# Altium schematic sheet PIC32MK_ACB.SchDoc: PIC32MK
size A4; Author: Milomir Spajić; Organization: Memristor-Robotics; Address1: Vladimira Perića Valtera; Address2: Novi Sad, 21000; Address3: Serbia; SheetNumber: 8; SheetTotal: 13
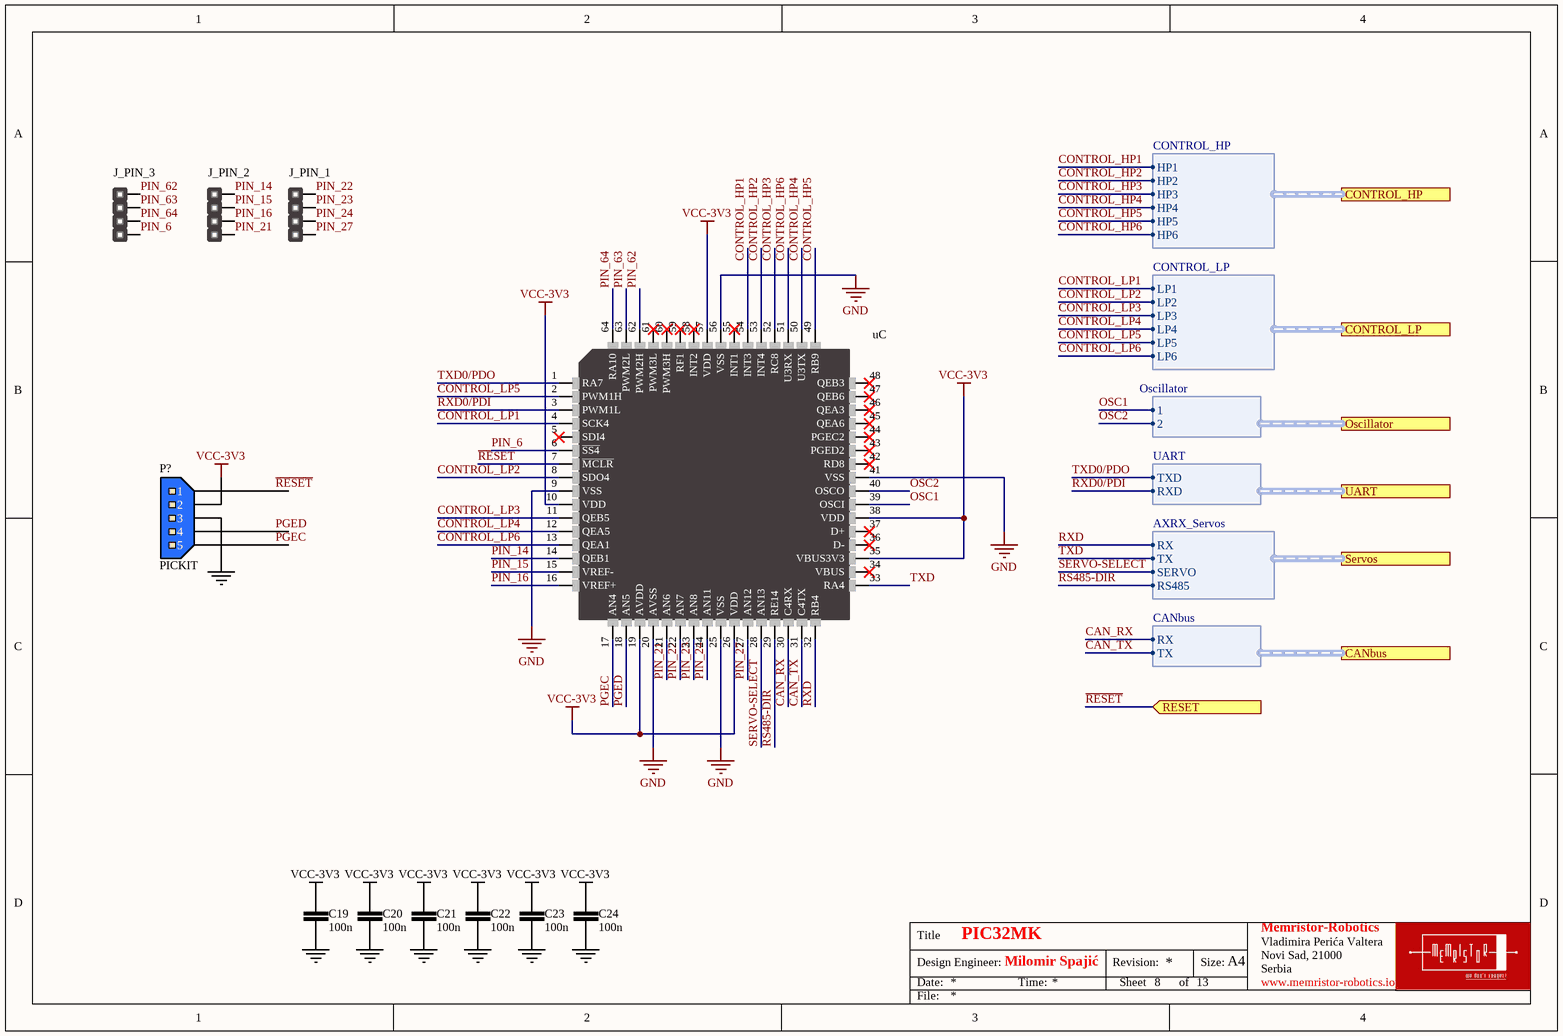
[diagram p0: PIC32MK_ACB.SchDoc]

## Parts
C19  100n  [CER_0603]
C20  100n  [CER_0603]
C21  100n  [CER_0603]
C22  100n  [CER_0603]
C23  100n  [CER_0603]
C24  100n  [CER_0603]
J_PIN_1  HEADER_1x4  [HM1X4]  (value not drawn)
J_PIN_2  HEADER_1x4  [HM1X4]  (value not drawn)
J_PIN_3  HEADER_1x4  [HM1X4]  (value not drawn)
P?  PICKIT  [TE CONNECTIVITY_5PIN_MALE]
uC  (no value)  [TQFP-64-500um]

## Ports
CANbus (harness CANbus), CONTROL_HP (harness CONTROL_HP), CONTROL_LP (harness CONTROL_LP), Oscillator (harness Oscillator), RESET (in), Servos (harness AXRX_Servos), UART (harness UART)

## Harnesses
CONTROL_HP: HP1, HP2, HP3, HP4, HP5, HP6
CONTROL_LP: LP1, LP2, LP3, LP4, LP5, LP6
Oscillator: 1, 2
UART: TXD, RXD
AXRX_Servos: RX, TX, SERVO, RS485
CANbus: RX, TX

## Nets
GND: C19.1 C20.1 C21.1 C22.1 C23.1 C24.1 P?.3 uC.9(VSS) uC.20(AVSS) uC.25(VSS) uC.41(VSS) uC.56(VSS)
VCC-3V3: C19.2 C20.2 C21.2 C22.2 C23.2 C24.2 P?.2 uC.10(VDD) uC.19(AVDD) uC.26(VDD) uC.35(VBUS3V3) uC.38(VDD) uC.57(VDD)
CAN_RX: uC.30(C4RX) ; port CANbus.RX
CAN_TX: uC.31(C4TX) ; port CANbus.TX
CONTROL_HP1: uC.54(INT3) ; port CONTROL_HP.HP1
CONTROL_HP2: uC.53(INT4) ; port CONTROL_HP.HP2
CONTROL_HP3: uC.52(RC8) ; port CONTROL_HP.HP3
CONTROL_HP4: uC.50(U3TX) ; port CONTROL_HP.HP4
CONTROL_HP5: uC.49(RB9) ; port CONTROL_HP.HP5
CONTROL_HP6: uC.51(U3RX) ; port CONTROL_HP.HP6
CONTROL_LP1: uC.4(SCK4) ; port CONTROL_LP.LP1
CONTROL_LP2: uC.8(SDO4) ; port CONTROL_LP.LP2
CONTROL_LP3: uC.11(QEB5) ; port CONTROL_LP.LP3
CONTROL_LP4: uC.12(QEA5) ; port CONTROL_LP.LP4
CONTROL_LP5: uC.2(PWM1H) ; port CONTROL_LP.LP5
CONTROL_LP6: uC.13(QEA1) ; port CONTROL_LP.LP6
OSC1: uC.39(OSCI) ; port Oscillator.1
OSC2: uC.40(OSCO) ; port Oscillator.2
PGEC: P?.5 uC.17(AN4)
PGED: P?.4 uC.18(AN5)
PIN_6: J_PIN_3.1 uC.6(~{SS4})
PIN_14: J_PIN_2.4 uC.14(QEB1)
PIN_15: J_PIN_2.3 uC.15(VREF-)
PIN_16: J_PIN_2.2 uC.16(VREF+)
PIN_21: J_PIN_2.1 uC.21(AN6)
PIN_22: J_PIN_1.4 uC.22(AN7)
PIN_23: J_PIN_1.3 uC.23(AN8)
PIN_24: J_PIN_1.2 uC.24(AN11)
PIN_27: J_PIN_1.1 uC.27(AN12)
PIN_62: J_PIN_3.4 uC.62(PWM2H)
PIN_63: J_PIN_3.3 uC.63(PWM2L)
PIN_64: J_PIN_3.2 uC.64(RA10)
~{RESET}: P?.1 uC.7(~{MCLR}) ; port RESET
RS485-DIR: uC.29(RE14) ; port Servos.RS485
RXD: uC.32(RB4) ; port Servos.RX
RXD0/PDI: uC.3(PWM1L) ; port UART.RXD
SERVO-SELECT: uC.28(AN13) ; port Servos.SERVO
TXD: uC.33(RA4) ; port Servos.TX
TXD0/PDO: uC.1(RA7) ; port UART.TXD

Not connected (* = marked no-connect by the designer): uC 5(SDI4)* 34(VBUS)* 36(D-)* 37(D+)* 42(RD8)* 43(PGED2)* 44(PGEC2)* 45(QEA6)* 46(QEA3)* 47(QEB6)* 48(QEB3)* 55(INT1)* 58(INT2)* 59(RF1)* 60(PWM3H)* 61(PWM3L)*

## Notes on the sheet
- Title
- Date:
- Design Engineer:
- Time:
- Revision:
- Sheet
- of
- Size:
- A4
- www.memristor-robotics.io
- File:

## Library data of the parts
C19-C24 = 06032105: CAP CER 100n 10V X5R 10% 0603; Capacitance: 100n
P? = TE CONNECTIVITY_5PIN_MALE: BLUE_5PIN_CONECTOR; Manufacturer: TE CONNECTIVITY / AMP; Manufacturer Part Number 1: 281695-3; Order Code 1: 1205983; Price 1: £0.403; Supplier 1: uk.farnell.com
uC = PIC32MK1024MCF064: IC MCU 32BIT 1MB FLASH 64TQFP; Manufacturer Part Number: PIC32MK1024MCF064